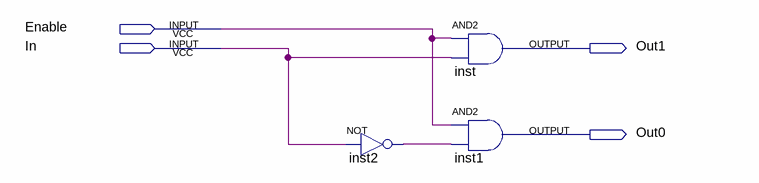
[diagram p0: schematic sheet]
// Quartus schematic OneToTwoDecoder.bdf as structural Verilog: 3 symbols, 4 pins
module OneToTwoDecoder (
  input  Enable,
  input  In,
  output Out1,
  output Out0
);

  wire inst2_out;

  not inst2 (inst2_out, In);
  and inst (Out1, Enable, In);
  and inst1 (Out0, Enable, inst2_out);
endmodule
